# EAGLE design mintymp3 v1.1 (EAGLE 6.6.0)
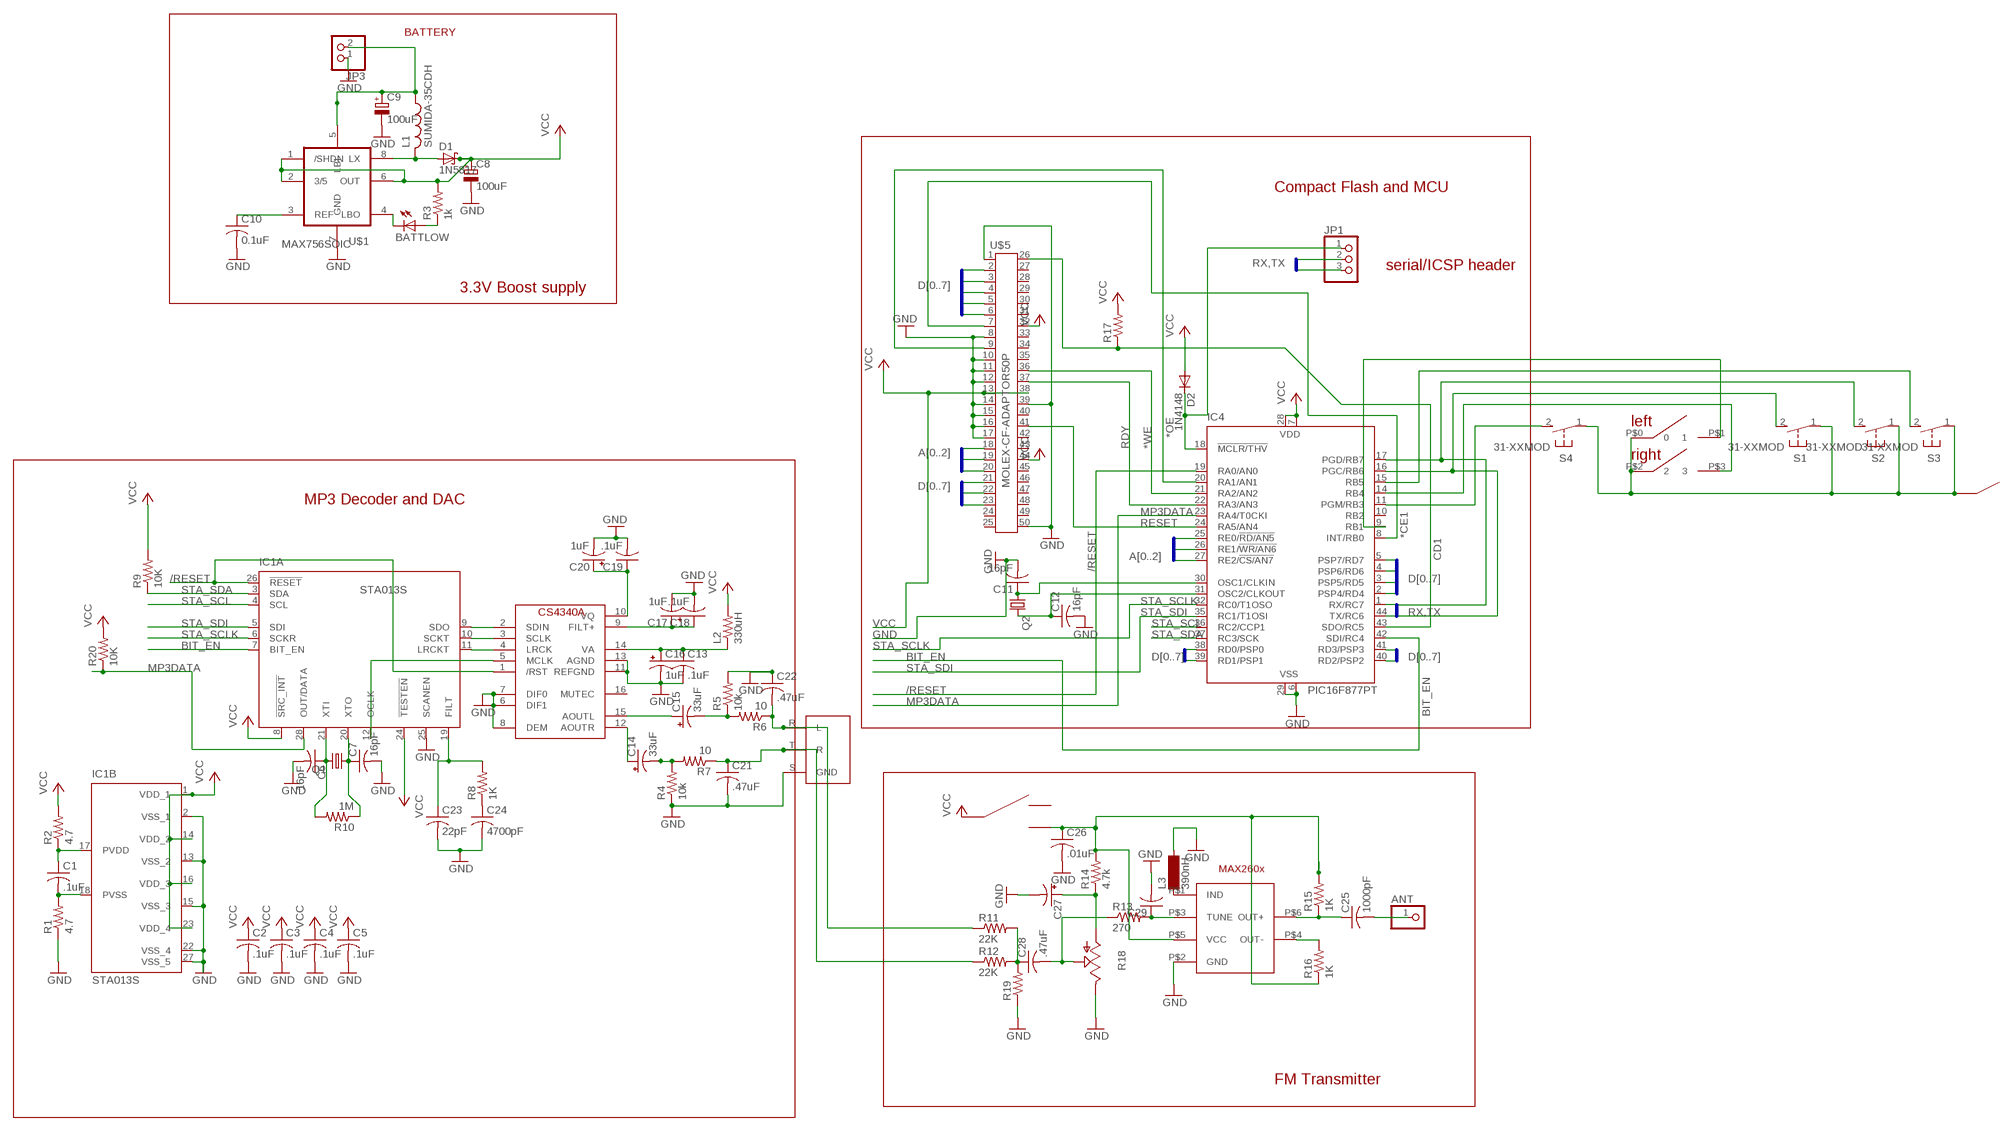
[diagram p0: schematic, sheet 1, part 1 of 2]
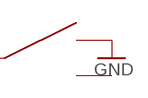
[diagram p1: schematic, sheet 1, part 2 of 2]

## Parts
ANT  PINHD-1X1  [1X01]
BATTLOW  LED3MM  [LED3MM]
C1  .1uF  C-USC1206  [C1206]
C2  .1uF  C-USC1206  [C1206]
C3  .1uF  C-USC1206  [C1206]
C4  .1uF  C-USC1206  [C1206]
C5  .1uF  C-USC1206  [C1206]
C6  16pF  C-USC1206  [C1206]
C7  16pF  C-USC1206  [C1206]
C8  100uF  CPOL-EUD  [PANASONIC_D]
C9  100uF  CPOL-EUD  [PANASONIC_D]
C10  0.1uF  C-USC1206  [C1206]
C11  16pF  C-USC1206  [C1206]
C12  16pF  C-USC1206  [C1206]
C13  .1uF  C-USC1206  [C1206]
C14  33uF  CPOL-USB  [PANASONIC_B]
C15  33uF  CPOL-USB  [PANASONIC_B]
C16  1uF  CPOL-USA  [PANASONIC_A]
C17  1uF  CPOL-USA  [PANASONIC_A]
C18  .1uF  C-USC1206  [C1206]
C19  .1uF  C-USC1206  [C1206]
C20  1uF  CPOL-USA  [PANASONIC_A]
C21  .47uF  C-USC1206  [C1206]
C22  .47uF  C-USC1206  [C1206]
C23  22pF  C-USC1206  [C1206]
C24  4700pF  C-USC1206  [C1206]
C25  1000pF  C-USC1206  [C1206]
C26  .01uF  C-USC1206  [C1206]
C27  CPOL-USB  [PANASONIC_B]
C28  .47uF  C-USC1206  [C1206]
C29  C-USC1206  [C1206]
D1  1N5817  SCHOTTKY-DIODEDO35-7  [DO35-7]
D2  1N4148  1N4148DO35-10  [DO35-10]
FM_SWITCH  SLIDE_SW  [SLIDESWITCH]
HEADPHONE  STEREOJACKSMDMOD  [SJ-3523-MODIFIED]
IC1  STA013S  [SO28W]
IC4  PIC16F877PT  [TQFP44]
JP1  PINHD-1X3  [1X03]
JP3  PINHD-1X2  [1X02]
L1  SUMIDA-35CDH  [CDH53]
L2  330uH  R-US_R1210  [R1210]
L3  390nH  SM-1206  [SM-1206]
Q1  CRYSTALHC49UP  [HC49UP]
Q2  CRYSTALHC49UP  [HC49UP]
R1  4.7  R-US_R1206  [R1206]
R2  4.7  R-US_R1206  [R1206]
R3  1k  R-US_R1206  [R1206]
R4  10k  R-US_R1206  [R1206]
R5  10k  R-US_R1206  [R1206]
R6  10  R-US_R1206  [R1206]
R7  10  R-US_R1206  [R1206]
R8  1K  R-US_R1206  [R1206]
R9  10K  R-US_R1206  [R1206]
R10  1M  R-US_R1206  [R1206]
R11  22K  R-US_R1206  [R1206]
R12  22K  R-US_R1206  [R1206]
R13  270  R-US_R1206  [R1206]
R14  4.7k  R-US_R1206  [R1206]
R15  1K  R-US_R1206  [R1206]
R16  1K  R-US_R1206  [R1206]
R17  R-US_R1206  [R1206]
R18  TRIM_US-ECP10P  [ECP10P]
R19  R-US_R1206  [R1206]
R20  10K  R-US_R1206  [R1206]
S1  31-XXMOD  [B3F-31XX-MODIFIED]
S2  31-XXMOD  [B3F-31XX-MODIFIED]
S3  31-XXMOD  [B3F-31XX-MODIFIED]
S4  31-XXMOD  [B3F-31XX-MODIFIED]
U$1  MAX756SOIC  [SO08]
U$2  SLIDE_SW  [SLIDESWITCH]
U$3  TPC_SWITCH  [TPC_SCAN]
U$4  CS4340A  [SO16]
U$5  MOLEX-CF-ADAPTOR50P  [COMPACTFLASH]
U$9  MAX260X  [SOT23-6]

## Nets
*CE1: IC4.8(INT/RB0) U$5.7
*OE: IC4.20(RA1/AN1) U$5.9
*WE: IC4.21(RA2/AN2) U$5.36
/RESET: IC1.26(A:!RESET) IC4.19(RA0/AN0) U$4.1(/RST)
A0: IC4.25(RE0/!RD/AN5) U$5.20
A1: IC4.26(RE1/!WR/AN6) U$5.19
A2: IC4.27(RE2/!CS/AN7) U$5.18
ANTENNA: ANT.1 C25.2
BIT_EN: IC1.7(A:BIT_EN) IC4.42(SDI/RC4)
BUTTON1: IC4.11(PGM/RB3) S4.2(S)
CD1: IC4.43(SDO/RC5) R17.1 U$5.26
D0: IC4.38(RD0/PSP0) U$5.21
D1: IC4.39(RD1/PSP1) U$5.22
D2: IC4.40(RD2/PSP2) U$5.23
D3: IC4.41(RD3/PSP3) U$5.2
D4: IC4.2(PSP4/RD4) U$5.3
D5: IC4.3(PSP5/RD5) U$5.4
D6: IC4.4(PSP6/RD6) U$5.5
D7: IC4.5(PSP7/RD7) U$5.6
GND: C2.2 C3.2 C4.2 C5.2 C6.2 C7.2 C8.- C9.- C10.2 C11.2 C12.2 C13.2 C16.- C17.- C18.2 C19.2 C20.- C21.2 C22.1 C23.2 C24.2 C26.2 C27.- C29.2 HEADPHONE.S(GND) IC1.2(B:VSS_1) IC1.13(B:VSS_2) IC1.15(B:VSS_3) IC1.22(B:VSS_4) IC1.25(A:SCANEN) IC1.27(B:VSS_5) IC4.6(VSS) IC4.29(VSS) JP3.1 L3.2 R1.1 R4.1 R5.2 R18.E R19.1 U$1.7(GND) U$2.P$1 U$4.6(DIF1) U$4.7(DIF0) U$4.8(DEM) U$4.11(REFGND) U$4.13(AGND) U$5.1 U$5.8 U$5.10 U$5.11 U$5.12 U$5.14 U$5.15 U$5.16 U$5.17 U$5.39 U$5.50 U$9.P$2(GND)
MCLR: D2.C IC4.18(!MCLR/THV) JP1.1
MP3DATA: IC1.28(A:OUT/DATA) IC4.23(RA4/T0CKI) R20.1
N$2: C26.1 FM_SWITCH.P$3 R14.2 R15.2 R16.1 U$9.P$5(VCC)
N$3: C6.1 IC1.21(A:XTI) Q1.2 R10.2
N$4: C7.1 IC1.20(A:XTO) Q1.1 R10.1
N$5: IC4.14(RB4) U$3.P$3
N$6: C1.1 IC1.17(B:PVDD) R2.1
N$7: C1.2 IC1.18(B:PVSS) R1.2
N$8: C9.+ JP3.2 L1.P$1 U$1.5(LBI)
N$9: D1.A L1.P$2 U$1.8(LX)
N$10: IC1.9(A:SDO) U$4.2(SDIN)
N$11: IC1.10(A:SCKT) U$4.3(SCLK)
N$12: IC1.11(A:LRCKT) U$4.4(LRCK)
N$13: IC1.12(A:OCLK) U$4.5(MCLK)
N$14: IC4.9(RB1) U$3.P$1
N$16: IC4.15(RB5) S3.2(S)
N$17: C15.+ U$4.15(AOUTL)
N$18: C10.1 U$1.3(REF)
N$19: BATTLOW.A R3.1
N$20: BATTLOW.K(C) U$1.4(LBO)
N$21: C13.1 C16.+ L2.1 U$4.14(VA)
N$22: C11.1 IC4.30(OSC1/CLKIN) Q2.1
N$23: C12.1 IC4.31(OSC2/CLKOUT) Q2.2
N$24: C14.+ U$4.12(AOUTR)
N$25: C14.- R4.2 R7.2
N$26: C15.- R5.1 R6.2
N$28: C22.2 HEADPHONE.R(L) R6.1 R11.1
N$29: C17.+ C18.1 U$4.9(FILT+)
N$30: C19.1 C20.+ U$4.10(VQ)
N$31: C29.1 R13.2 U$9.P$3(TUNE)
N$32: C24.1 R8.1
N$33: C23.1 IC1.19(A:FILT) R8.2
N$35: C25.1 R15.1 U$9.P$6(OUT+)
N$36: R16.2 U$9.P$4(OUT-)
N$37: C21.1 HEADPHONE.T(R) R7.1 R12.1
N$38: C28.1 R11.2 R12.2 R19.2
N$39: C27.+ R14.1 R18.A
N$40: C28.2 R13.1 R18.S
N$42: L3.1 U$9.P$1(IND)
N$43: S1.1(P) S2.1(P) S3.1(P) S4.1(P) U$2.P$2 U$3.P$0 U$3.P$2
RDY: IC4.22(RA3/AN3) U$5.37
RESET: IC4.24(RA5/AN4) U$5.41
RX: IC4.1(RX/RC7) IC4.17(PGD/RB7) JP1.2 S2.2(S)
STA_SCL: IC1.4(A:SCL) IC4.36(RC2/CCP1)
STA_SCLK: IC1.6(A:SCKR) IC4.32(RC0/T1OSO)
STA_SDA: IC1.3(A:SDA) IC4.37(RC3/SCK) R9.1
STA_SDI: IC1.5(A:SDI) IC4.35(RC1/T1OSI)
TX: IC4.16(PGC/RB6) IC4.44(TX/RC6) JP1.3 S1.2(S)
VCC: C2.1 C3.1 C4.1 C5.1 C8.+ D1.C D2.A FM_SWITCH.P$2 IC1.1(B:VDD_1) IC1.8(A:!SRC_INT) IC1.14(B:VDD_2) IC1.16(B:VDD_3) IC1.23(B:VDD_4) IC1.24(A:!TESTEN) IC4.7(VDD) IC4.28(VDD) L2.2 R2.2 R3.2 R9.2 R17.2 R20.2 U$1.1(/SHDN) U$1.2(3/5) U$1.6(OUT) U$5.13 U$5.32 U$5.38 U$5.44
Unconnected: FM_SWITCH.P$1 IC4.10(RB2) U$2.P$3 U$4.16(MUTEC) U$5.24 U$5.25 U$5.27 U$5.28 U$5.29 U$5.30 U$5.31 U$5.33 U$5.34 U$5.35 U$5.40 U$5.42 U$5.43 U$5.45 U$5.46 U$5.47 U$5.48 U$5.49

## Buses
D[0..7]
A[0..2]
RX,TX

## Notes on the sheet
- BATTERY
- Compact Flash and MCU
- serial/ICSP header
- 3.3V Boost supply
- MP3 Decoder and DAC
- FM Transmitter

## Library data of the parts
ANT = pinhead:PINHD-1X1: PIN HEADER
BATTLOW = led:LED: LED OSRAM: - CHIPLED LG R971, LG N971, LY N971, LG Q971, LY Q971, LO R971, LY R971 LH N974, LH R974 LS Q976, LO Q976, LY Q976 LO Q996 - Hyper CHIPLED LW Q18S LB Q993, LB Q99A, LB R99A - SideLED LS A670, LO A670, LY A670, LG A670, LP A670 LB A673, LV A673, LT A673, LW A673 LH A674 LY A675 LS A676, LA A676, LO A676, LY A676, LW A676 LS A679, LY A679, LG A679 - Hyper Micro SIDELED® LS Y876, LA Y876, LO Y876, LY Y876 LT Y87S - SmartLED LW L88C, LW L88S LB L89C, LB L89S, LG L890 LS L89K, LO L89K, LY L89K LS L896, LA L896, LO L896, LY L896 - TOPLED LS T670, LO T670, LY T670, LG T670, LP T670 LSG T670, LSP T670, LSY T670, LOP T670, LYG T670 LG T671, LOG T671, LSG T671 LB T673, LV T673, LT T673, LW T673 LH T674 LS T676, LA T676, LO T676, LY T676, LB T676, LH T676, LSB T676, LW T676 LB T67C, LV T67C, LT T67C, LS T67K, LO T67K, LY T67K, LW E67C LS E67B, LA E67B, LO E67B, LY E67B, LB E67C, LV E67C, LT E67C LW T67C LS T679, LY T679, LG T679 LS T770, LO T770, LY T770, LG T770, LP T770 LB T773, LV T773, LT T773, LW T773 LH T774 LS E675, LA E675, LY E675, LS T675 LS T776, LA T776, LO T776, LY T776, LB T776 LHGB T686 LT T68C, LB T68C - Hyper Mini TOPLED® LB M676 - Mini TOPLED Santana® LG M470 LS M47K, LO M47K, LY M47K Source: http://www.osram.convergy.de LUXEON: - LUMILED® LXK2-PW12-R00, LXK2-PW12-S00, LXK2-PW14-U00, LXK2-PW14-V00 LXK2-PM12-R00, LXK2-PM12-S00, LXK2-PM14-U00 LXK2-PE12-Q00, LXK2-PE12-R00, LXK2-PE12-S00, LXK2-PE14-T00, LXK2-PE14-U00 LXK2-PB12-K00, LXK2-PB12-L00, LXK2-PB12-M00, LXK2-PB14-N00, LXK2-PB14-P00, LXK2-PB14-Q00 LXK2-PR12-L00, LXK2-PR12-M00, LXK2-PR14-Q00, LXK2-PR14-R00 LXK2-PD12-Q00, LXK2-PD12-R00, LXK2-PD12-S00 LXK2-PH12-R00, LXK2-PH12-S00 LXK2-PL12-P00, LXK2-PL12-Q00, LXK2-PL12-R00 Source: www.luxeon.com KINGBRIGHT: KA-3528ASYC Source: www.kingbright.com
C1-C7 C10-C13 C18 C19 C21-C26 C28 C29 = rcl:C-US: CAPACITOR, American symbol
C8 C9 = rcl:CPOL-EU: POLARIZED CAPACITOR, European symbol
C14-C17 C20 C27 = rcl:CPOL-US: POLARIZED CAPACITOR, American symbol
D1 = diode:SCHOTTKY-DIODE: Schottky Diode
D2 = diode:1N4148: DIODE high speed (Philips)
FM_SWITCH U$2 = mp3:SLIDE_SW
HEADPHONE = mp3:STEREOJACK: CUI SJ-3533-N
IC1 = st-microelectronics:STA013S: MP3 AUDIO DECODER; MPN: STA013$; OC_FARNELL: unknown; OC_NEWARK: 57P0489
IC4 = microchip:PIC16F87*: MICROCONTROLLER; MF: MICROCHIP; MPN: PIC16F877-04/PQ; OC_FARNELL: 9761411; OC_NEWARK: 23C5094
JP1 = pinhead:PINHD-1X3: PIN HEADER
JP3 = pinhead:PINHD-1X2: PIN HEADER
L1 = mp3:SUMIDA-35CDH
L2 R1-R17 R19 R20 = rcl:R-US_: RESISTOR, American symbol
L3 = inductor-neosid:SM-1206: INDUCTOR SMD chip inductor; OC_FARNELL: unknown; OC_NEWARK: unknown
Q1 Q2 = crystal:CRYSTAL: CRYSTAL; OC_FARNELL: unknown; OC_NEWARK: unknown
R18 = pot:TRIM_US-: POTENTIOMETER
S1-S4 = mp3:31-XX: OMRON SWITCH
U$1 = mp3:MAX756
U$3 = mp3:TPC_SWITCH
U$4 = mp3:CS4340A
U$5 = mp3:MOLEX-CF-ADAPTOR
U$9 = mp3:MAX260X

## Board
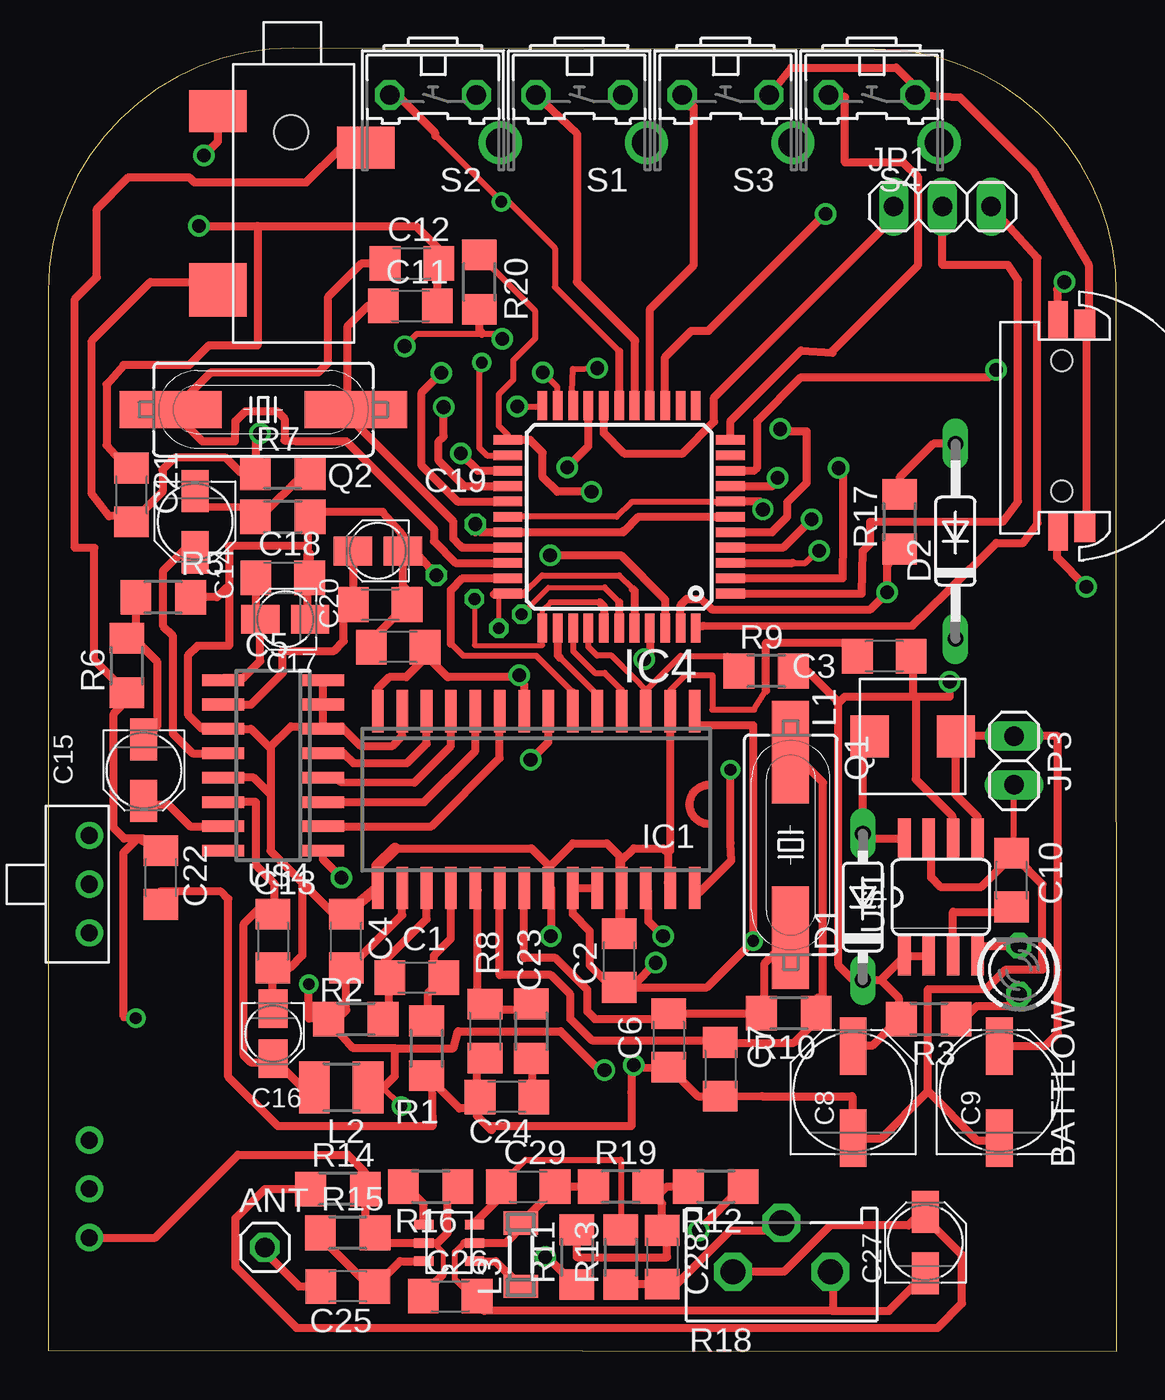
[diagram p2: board, top side]
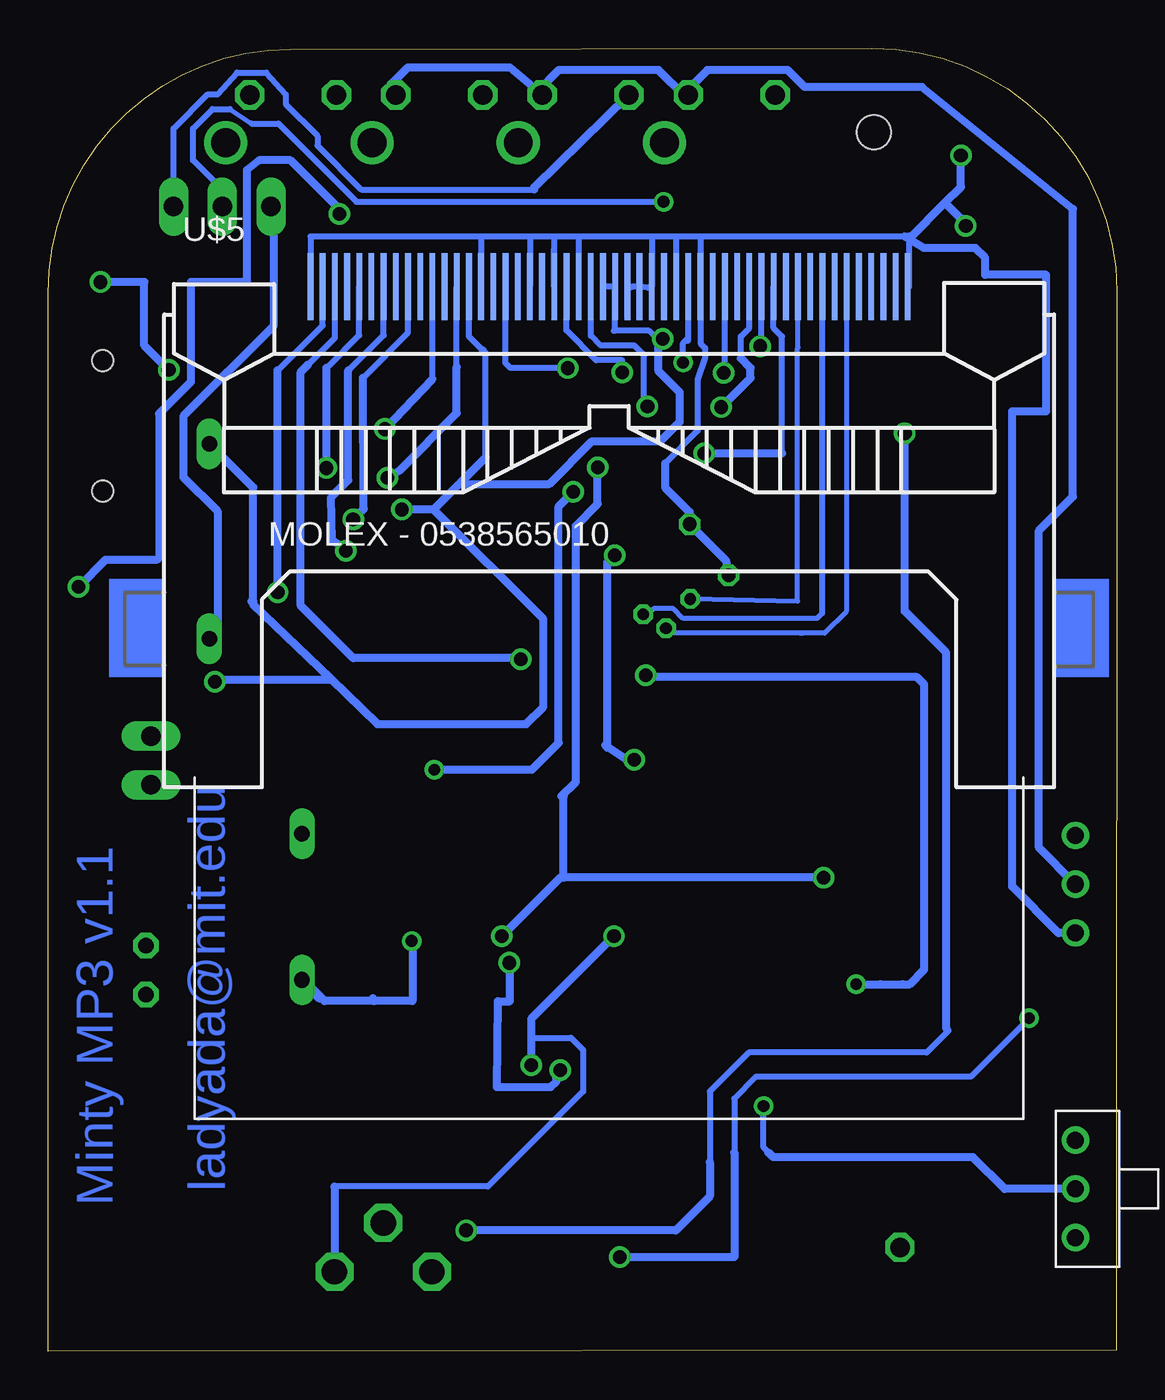
[diagram p3: board, bottom side, seen from below]

Size 55.69 x 67.92 mm. Coordinates in mm from the lower left corner, seen from the top.
Outline: 0.02,0.05 55.69,0 55.67,55.15 arc90 43.06,67.86 12.76,67.91 arc90 0,55.24 0.02,0.05
Copper layers (1*16): Top 0.035mm / dielectric 1.5mm / Bottom 0.035mm
Design rules "default": minimum track width 10mil, minimum drill 24mil, track to track 10mil, track to pad 10mil, pad to pad 10mil, via to via 10mil, smd to smd 8mil, copper to edge 20mil, drill to drill 8mil, minimum pad ring 10mil, minimum via ring 8mil, stop-mask expansion 4mil, vias tented up to drill 0mil, thermal gap 10mil

### Footprints (pad centres in the part's own frame; a part is rotated, then mirrored left to right if it is on the bottom)
1X01 = drill 1.016 octagon: 1 0,0
LED3MM = drill 0.813 octagon: A -1.27,0; K 1.27,0
C1206 = smd 1.6 x 1.8: 1 -1.4,0; 2 1.4,0
PANASONIC_D = smd 3 x 1.4: + 2.4,0; - -2.4,0
PANASONIC_B = smd 2.2 x 1.4: + 1.6,0; - -1.6,0
PANASONIC_A = smd 2 x 1.5: + 1.3,0; - -1.3,0
DO35-7 = drill 0.813 long: A 3.81,0; C -3.81,0
DO35-10 = drill 0.813 long: A 5.08,0; C -5.08,0
SLIDESWITCH = drill 0.889 pad 1.422: P$1 -2.54,1.016; P$2 0,1.016; P$3 2.54,1.016
SJ-3523-MODIFIED = smd 2.2 x 3: R -3.27,3.82; S -5.17,-3.88 | smd 2.8 x 3: T 4.13,-3.88 | hole 1.778: -4.07,-0.08
SO28W = smd 0.6 x 2.2: 1 -8.255,-4.6; 2 -6.985,-4.6; 3 -5.715,-4.6; 4 -4.445,-4.6; 5 -3.175,-4.6; 6 -1.905,-4.6; 7 -0.635,-4.6; 8 0.635,-4.6; 9 1.905,-4.6; 10 3.175,-4.6; 11 4.445,-4.6; 12 5.715,-4.6; 13 6.985,-4.6; 14 8.255,-4.6; 15 8.255,4.6; 16 6.985,4.6; 17 5.715,4.6; 18 4.445,4.6; 19 3.175,4.6; 20 1.905,4.6; 21 0.635,4.6; 22 -0.635,4.6; 23 -1.905,4.6; 24 -3.175,4.6; 25 -4.445,4.6; 26 -5.715,4.6; 27 -6.985,4.6; 28 -8.255,4.6
TQFP44 = smd 1.5 x 0.5: 1 -5.8,4; 2 -5.8,3.2; 3 -5.8,2.4; 4 -5.8,1.6; 5 -5.8,0.8; 6 -5.8,0; 7 -5.8,-0.8; 8 -5.8,-1.6; 9 -5.8,-2.4; 10 -5.8,-3.2; 11 -5.8,-4; 23 5.8,-4; 24 5.8,-3.2; 25 5.8,-2.4; 26 5.8,-1.6; 27 5.8,-0.8; 28 5.8,0; 29 5.8,0.8; 30 5.8,1.6; 31 5.8,2.4; 32 5.8,3.2; 33 5.8,4 | smd 0.5 x 1.5: 12 -4,-5.8; 13 -3.2,-5.8; 14 -2.4,-5.8; 15 -1.6,-5.8; 16 -0.8,-5.8; 17 0,-5.8; 18 0.8,-5.8; 19 1.6,-5.8; 20 2.4,-5.8; 21 3.2,-5.8; 22 4,-5.8; 34 4,5.8; 35 3.2,5.8; 36 2.4,5.8; 37 1.6,5.8; 38 0.8,5.8; 39 0,5.8; 40 -0.8,5.8; 41 -1.6,5.8; 42 -2.4,5.8; 43 -3.2,5.8; 44 -4,5.8
1X03 = drill 1.016 long: 1 -2.54,0; 2 0,0; 3 2.54,0
1X02 = drill 1.016 long: 1 -1.27,0; 2 1.27,0
CDH53 = smd 2.2 x 2: P$1 1,1; P$2 1,5.5
R1210 = smd 1.6 x 2.7: 1 -1.4,0; 2 1.4,0
SM-1206 = smd 1.2 x 1.8: 1 -1.65,0; 2 1.65,0
HC49UP = smd 5.334 x 1.93: 1 -4.826,0; 2 4.826,0
R1206 = smd 1.6 x 1.803: 1 -1.422,0; 2 1.422,0
ECP10P = drill 1.321 octagon: A -2.54,0; E 2.54,0; S 0,2.54
B3F-31XX-MODIFIED = drill 1.016 octagon: 1 -2.261,-1.245; 2 2.261,-1.245 | drill 1.499 pad 2.159: 3 -3.505,1.245
SO08 = smd 0.66 x 2.032: 1 -1.905,-3.073; 2 -0.635,-3.073; 3 0.635,-3.073; 4 1.905,-3.073; 5 1.905,3.073; 6 0.635,3.073; 7 -0.635,3.073; 8 -1.905,3.073
TPC_SCAN = smd 1.5 x 1.1: P$0 -5.3,1.2; P$2 5.3,1.2 | smd 2 x 1: P$1 -5.5,-0.2; P$3 5.5,-0.2 | hole 1.1: -3.4,0; 3.4,0
SO16 = smd 0.6 x 2.2: 1 -4.445,-2.6; 2 -3.175,-2.6; 3 -1.905,-2.6; 4 -0.635,-2.6; 5 0.635,-2.6; 6 1.905,-2.6; 7 3.175,-2.6; 8 4.445,-2.6; 9 4.445,2.6; 10 3.175,2.6; 11 1.905,2.6; 12 0.635,2.6; 13 -0.635,2.6; 14 -1.905,2.6; 15 -3.175,2.6; 16 -4.445,2.6
COMPACTFLASH = smd 0.3 x 3.5: 1 -16.828,10.335; 2 -15.557,10.335; 3 -14.287,10.335; 4 -13.018,10.335; 5 -11.748,10.335; 6 -10.477,10.335; 7 -9.207,10.335; 8 -7.938,10.335; 9 -6.668,10.335; 10 -5.397,10.335; 11 -4.128,10.335; 12 -2.857,10.335; 13 -1.587,10.335; 14 -0.318,10.335; 15 0.953,10.335; 16 2.223,10.335; 17 3.493,10.335; 18 4.763,10.335; 19 6.032,10.335; 20 7.303,10.335; 21 8.572,10.335; 22 9.842,10.335; 23 11.113,10.335; 24 12.383,10.335; 25 13.652,10.335; 26 -16.192,10.335; 27 -14.922,10.335; 28 -13.652,10.335; 29 -12.383,10.335; 30 -11.113,10.335; 31 -9.842,10.335; 32 -8.572,10.335; 33 -7.303,10.335; 34 -6.032,10.335; 35 -4.763,10.335; 36 -3.493,10.335; 37 -2.223,10.335; 38 -0.953,10.335; 39 0.318,10.335; 40 1.587,10.335; 41 2.857,10.335; 42 4.128,10.335; 43 5.397,10.335; 44 6.668,10.335; 45 7.938,10.335; 46 9.207,10.335; 47 10.477,10.335; 48 11.748,10.335; 49 13.018,10.335; 50 14.287,10.335
SOT23-6 = smd 0.5 x 1: P$1 0.3,0.5; P$2 1.25,0.5; P$3 2.2,0.5; P$4 2.2,3.15; P$5 1.25,3.15; P$6 0.3,3.15

### Placement (x,y rotation side)
ANT  11.3,5.42 0 top
BATTLOW  50.59,19.87 90 top
C1  19.22,19.49 0 top
C2  29.76,20.38 90 top
C3  43.58,36.22 180 top
C4  15.54,21.39 90 top
C5  18.25,36.7 180 top
C6  32.35,16.21 270 top
C7  35.03,14.71 270 top
C8  41.95,13.52 90 top
C9  49.57,13.52 90 top
C10  50.21,24.57 90 top
C11  18.88,54.48 0 top
C12  18.96,56.7 0 top
C13  11.73,21.39 270 top
C14  7.66,43.23 270 top
C15  4.99,30.28 270 top
C16  11.73,16.57 270 top
C17  12.36,38.16 180 top
C18  12.23,40.31 0 top
C19  17.31,38.92 0 top
C20  17.19,41.71 180 top
C21  4.36,44.63 90 top
C22  5.88,24.69 90 top
C23  22.77,16.69 270 top
C24  23.92,13.26 180 top
C25  15.62,3.39 180 top
C26  20.95,2.88 0 top
C27  45.72,5.68 90 top
C28  32,4.92 270 top
C29  25.02,8.6 0 top
D1  42.46,23.17 90 top
D2  47.29,42.22 90 top
FM_SWITCH  3.17,8.47 270 bottom
HEADPHONE  12.74,59.45 270 top
IC1  25.44,28.76 180 top
IC4  29.76,43.49 180 top
JP1  46.61,59.65 0 top
JP3  50.33,30.79 90 top
L1  48.3,31.04 90 top
L2  15.28,13.77 0 top
L3  24.64,5.04 90 top
Q1  38.7,26.4 270 top
Q2  11.22,49.08 180 top
R1  19.73,15.8 90 top
R2  16.04,17.33 180 top
R3  45.89,17.33 180 top
R4  12.23,43.49 180 top
R5  6.01,39.3 0 top
R6  4.11,35.74 90 top
R7  12.23,45.77 0 top
R8  25.19,16.69 90 top
R9  37.42,35.46 0 top
R10  38.6,17.64 180 top
R11  27.56,4.92 90 top
R12  34.8,8.6 180 top
R13  29.84,4.92 90 top
R14  15.11,8.47 0 top
R15  15.62,6.19 0 top
R16  19.94,8.6 180 top
R17  44.36,43.23 90 top
R18  38.23,4.15 0 top
R19  29.84,8.6 0 top
R20  22.48,55.72 270 top
S1  27.69,64.22 180 top
S2  20.07,64.22 180 top
S3  35.31,64.22 180 top
S4  42.93,64.22 180 top
U$1  46.52,23.68 0 top
U$2  3.17,24.35 90 top
U$3  52.83,48.22 270 top
U$4  11.73,30.54 90 top
U$5  25.19,45.14 0 bottom
U$9  22.73,4.41 90 top

### Tracks (layer width: path | path; a pad name or v marks a point on that pad's centre or on a via)
*CE1  (via drill 0.71)
  Top 0.406: IC4.8 37.77,45.1 38.14,45.47 v38.01,45.52
  Bottom 0.305: 34.4,51.3 U$5.7
  Bottom 0.406: v38.01,45.52 37.37,45.9 34.4,48.88 34.4,51.3
*OE  (via drill 0.71)
  Top 0.305: v28.62,51.24 27.35,51.19 27.3,50 27.36,49.95 IC4.20
  Bottom 0.305: v28.62,51.24 31.59,51.24 31.86,51.5 U$5.9
*WE  (via drill 0.71)
  Top 0.305: v25.78,51.02 26.54,50.26 26.54,49.37 26.56,49.35 IC4.21
  Bottom 0.305: U$5.36 28.68,53.2 27.13,51.65 25.78,51.65 v25.78,51.02
/RESET  (via drill 0.71)
  Top 0.406: v32.05,21.64 31.28,22.41 31.28,23.93 31.16,23.93 | 31.16,23.93 31.03,23.93 | 31.16,23.93 IC1.26 | U$4.1 14.33,25.65 v15.28,24.69 | IC4.19 28.16,47.17 v27.05,46.06
  Bottom 0.406: v15.28,24.69 28.83,24.69 | 28.83,24.69 29,24.69 v32.05,21.64 30.74,22.95 | v27.05,46.06 27.05,44.16 28.19,43.02 28.19,29.68 28.96,28.92 28.83,28.92 28.83,24.69
A0  (via drill 0.71)
  Top 0.406: IC4.25 22.41,45.89 v21.5,46.79
  Bottom 0.305: U$5.20 17.89,53.33 17.44,52.89 17.44,46.79
  Bottom 0.406: 17.44,46.79 v21.5,46.79
A1  (via drill 0.71)
  Top 0.406: v20.62,49.2 20.62,47.68 20.36,47.43 20.36,46.41 21.68,45.09 IC4.26
  Bottom 0.305: U$5.19 19.16,53.33 19.6,52.89 19.6,51.74
  Bottom 0.406: 19.6,51.74 19.09,51.24 19.09,50.73 v20.62,49.2
A2  (via drill 0.71)
  Top 0.406: v20.49,50.98 19.47,49.97 19.47,46.16 21.34,44.29 IC4.27
  Bottom 0.305: 20.43,51.17 U$5.18
  Bottom 0.406: v20.49,50.98 20.43,51.17
ANTENNA
  Top 0.406: ANT.1 11.3,5.17 13.08,3.39 C25.2
BIT_EN  (via drill 0.71)
  Top 0.406: IC4.42 32.16,39.18 29.84,41.49 v26.16,41.49 | IC1.7 26.08,31.76 v25.15,30.82
  Bottom 0.406: v26.16,41.49 26.54,41.11 26.54,31.46 26.67,31.59 25.53,30.82 v25.15,30.82
BUTTON1
  Top 0.406: IC4.11 35.56,48.48 39.24,52.16 40.89,52.03 40.89,52.16 45.34,56.61 45.34,61.18 44.58,61.94 41.53,61.94 41.53,65.37 41.3,65.37 S4.2
CD1  (via drill 0.71)
  Top 0.406: 32.96,37.62 IC4.43 32.96,38.89 33.27,39.21 34.04,39.21 34.2,39.04 34.59,38.66 42.84,38.66 v43.73,39.55 43.73,40.95 44.34,41.81 R17.1
  Bottom 0.305: U$5.26 41.38,53.46 43.73,51.11
  Bottom 0.406: v43.73,39.55 43.73,51.11
D0  (via drill 0.61)
  Top 0.254: 26.2,39.04 25.78,38.62 25.78,36.79 22.22,36.79 v22.22,39.21
  Top 0.305: 26.2,39.04 28.74,39.04
  Top 0.406: IC4.38 28.96,38.82 28.74,39.04
  Bottom 0.254: v22.22,39.21 16.64,39.08 16.64,52.29 16.61,52.31 U$5.21
D1  (via drill 0.61)
  Top 0.254: 29,39.81 26.08,39.81 v24.68,38.41
  Top 0.305: 29,39.81 29.76,39.04
  Top 0.406: 29.76,39.04 IC4.39
  Bottom 0.254: 15.35,38.47 15.37,38.45 15.37,38.44 15.62,38.19 22.61,38.19 23.11,38.7 24.14,38.7 24.39,38.44 v24.68,38.41
  Bottom 0.305: 15.35,55.49 U$5.22 15.35,38.47
D2  (via drill 0.61)
  Top 0.254: 23.24,39.46 23.49,39.33 v23.49,37.68
  Top 0.305: 30.52,39.68 30.48,39.72 29.76,40.44 25.75,40.44 24.76,39.46
  Top 0.406: 30.48,39.72 30.48,39.71 30.56,39.63 IC4.40 | 23.24,39.46 24.76,39.46
  Bottom 0.254: v23.49,37.68 23.49,37.43 16.51,37.43 | 16.51,37.43 16.38,37.43 | U$5.23 14.07,38.59 15.24,37.43 16.51,37.43
D3  (via drill 0.71)
  Top 0.406: v31.06,36.07 31.06,36.11 31.36,36.4 IC4.41
  Bottom 0.305: 42.21,51.36 42.17,51.4 40.74,52.82 U$5.2
  Bottom 0.406: v31.06,36.07 v31.08,36.07 31.11,36.03 31.21,36.12 39.79,36.12 42.52,38.85 42.52,51.04 42.16,51.4 42.17,51.4
D4  (via drill 0.71)
  Top 0.406: IC4.2 41.42,40.29 41.44,42.35 41.44,45.77 v41.19,46.03
  Bottom 0.305: 41.19,51.24 41.06,51.36 39.48,52.94 U$5.3
  Bottom 0.406: v41.19,46.03 41.19,51.24
D5  (via drill 0.71)
  Top 0.305: v40.17,41.71 40.13,41.75 39.47,41.09 38.79,41.09
  Top 0.406: IC4.3 38.79,41.09
  Bottom 0.305: U$5.4 38.2,52.95 40.05,51.11
  Bottom 0.406: v40.17,41.71 40.17,41.79 40.89,42.25 40.94,44.51 40.05,45.39 40.05,51.11
D6  (via drill 0.71)
  Top 0.406: IC4.4 38.32,41.89 v39.79,43.36
  Bottom 0.305: U$5.5 36.94,53.08 39.28,50.73
  Bottom 0.406: v39.79,43.36 39.54,43.61 39.24,43.91 39.28,50.73
D7  (via drill 0.71)
  Top 0.406: IC4.5 37.72,42.69 38.52,43.49 38.52,44.25 39.54,45.27 39.54,47.93 38.26,47.93 38.13,48.06 | 38.13,48.06 38.1,48.1 | 38.13,48.06 v38.14,48.06
  Bottom 0.305: 35.66,50.66 U$5.6
  Bottom 0.406: v38.14,48.06 35.66,50.66
GND  (via drill 0.71)
  Top 0.305: 32.3,25.96 32.43,26.09 | IC1.2 32.43,34.45 33.21,35.24 34.61,35.24 34.61,33.44 36.79,33.44 37.41,34.44 | 21.7,5.66 21.21,5.17 21.21,3.77 22.1,2.88 | 50.18,25.87 50.17,25.87 50.16,25.87 50.33,26.04 JP3.1
  Top 0.406: IC1.27 32.43,24.31 32.3,24.44 32.3,25.96 32.05,26.22 30.52,26.22 29.89,25.58 IC1.25 29.89,22.03 29.76,21.9 C2.2 29.76,25.84 29.12,26.47 27.35,26.47 26.08,25.2 | 26.08,25.2 26.08,25.33 25.19,26.22 18.08,26.22 | C19.2 18.33,38.54 | 30.4,14.78 C6.2 33.86,13.3 35.05,13.3 | v30.52,14.91 30.4,14.78 | v26.2,21.64 26.2,24.19 26.08,24.31 | 22.9,11.74 30.39,11.74 30.4,13.52 30.4,14.78 | 46.02,26.73 45.99,26.75 U$1.7 | 46.02,26.73 45.89,26.6 | 46.02,26.73 46.02,24.69 46.52,24.19 48.61,24.19 50.13,25.71 50.18,25.87 C10.2 50.45,25.71 51.82,24.35 51.82,19.9 49.91,19.9 48.89,18.89 45.85,18.89 45.85,13.57 | 11.6,29.01 11.6,31.42 11.56,31.46 | 13.25,24.44 13.25,20.63 12.61,19.99 C13.2 11.68,19.95 11.68,17.91 C16.- | 13.25,24.44 11.6,26.09 11.6,29.01 | 14.27,32.57 14.33,32.51 U$4.6 | 14.27,32.57 14.33,32.63 U$4.7 14.33,33.78 14.27,33.84 14.33,33.9 U$4.8 | 26.08,25.2 26.08,24.31 | 26.08,24.31 IC1.22 | 11.56,31.46 10.58,32.44 9.19,32.44 | 9.19,32.44 U$4.11 | 9.19,32.44 8.04,32.44 7.28,33.2 7.28,36.25 7.79,36.76 9.44,36.76 9.44,39.81 | 11.6,29.01 10.71,29.9 U$4.13 | 30.01,42.72 29.98,42.69 | 30.01,42.72 30.78,43.49 IC4.6 | 32.43,26.09 IC1.2 | v22.27,43.11 22.27,42.89 | 22.27,42.89 22.27,42.69 | IC1.13 18.46,33.33 | IC1.13 18.46,33.46 | 14.27,32.57 15.28,32.57 16.3,31.55 17.95,31.55 18.46,32.06 IC1.13 | 13.53,41.48 13.63,41.59 C18.2 | 13.53,43.74 13.53,41.97 | 13.53,41.97 13.53,41.48 | 13.53,43.74 R4.1 | 13.53,41.48 13.5,41.46 13.5,38.79 13.53,38.82 C17.- | 18.33,38.54 19.22,39.17 18.49,39.9 C20.- 18.36,42.7 | 18.36,42.7 17.44,43.74 13.53,43.74 | 18.36,42.7 18.52,42.47 | 9.44,39.81 9.44,41.97 13.53,41.97 | 18.36,42.7 18.61,42.32 v20.23,40.44
  Top 0.406: 9.44,39.81 9.31,39.81 8.8,39.3 R5.2 | 37.41,34.44 37.41,36.94 41.38,36.94 42.16,36.16 42.18,36.17 C3.2 42.12,36.22 | 35.05,13.3 | 35.05,13.3 C7.2 37.21,13.3 41.91,13.3 41.93,11.12 C8.- 43.41,11.12 45.85,13.55 45.85,13.57 | 22.35,12.79 22.3,12.79 C24.2 22.22,12.72 22.22,12.66 21.44,12.66 19.99,14.11 | C23.2 22.35,14.49 22.35,12.79 | 22.9,11.74 22.35,12.29 22.35,12.79 | 19.99,14.11 R1.1 | C9.- 49.66,11.03 49.66,11.01 48.41,11.01 45.85,13.57 | 11.56,31.46 | 14.27,32.57 12.66,32.57 11.56,31.46 | C22.1 5.85,23.97 9.02,23.97 9.4,23.59 9.4,14.32 11.98,11.74 20.03,11.74 19.99,14.11 | C4.2 15.5,22.82 14.87,22.82 13.25,24.44 | C5.2 16.94,36.79 17.02,36.79 17.02,37.22 18.33,38.54 | 21.7,5.66 U$9.P$2 23.86,5.66 24.76,6.57 L3.2 26.54,8.6 | 22.1,2.88 C26.2 22.35,2.5 22.73,2.12 40.89,2.12 | 26.54,8.6 C29.2 | 26.54,8.6 R19.1 | C27.- 45.72,4.03 43.81,2.12 40.89,2.12 | 40.89,2.12 40.89,4.03 R18.E | HEADPHONE.S 8.14,64.62 | HEADPHONE.S 9.23,64.99 | HEADPHONE.S 8.86,63.05 v8.13,62.32 | 20.45,56.61 C12.2 | C11.2 20.28,56.44 20.45,56.61 | 20.45,56.61 20.45,57.37 19.18,58.64 10.92,58.64 | C21.2 4.1,46.03 3.05,47.21 3.05,50.38 3.94,51.4 7.37,51.4 8.38,52.41 10.92,52.41 10.92,58.64 | 30.01,42.72 29.97,42.76 29.9,42.69 IC4.29 22.55,42.69 22.35,42.89 22.27,42.89 | 22.9,11.74 23.11,11.53 | v7.87,58.64 10.92,58.64
  Top 0.61: C4.2 17.09,24.09 17.14,24.09 17.14,24.12 IC1.15 17.14,24.2 17.14,25.29 18.08,26.22
  Bottom 0.305: 22.96,58.09 U$5.16 | 21.7,58.09 22.96,58.09 | 21.7,58.09 U$5.17 21.7,52.52 21.46,52.29 21.46,51.78 21.84,50.64 21.84,47.97 23.53,46.28 23.54,46.28 | 33.12,58.09 U$5.8 | 30.59,58.09 U$5.10 | 30.59,58.09 33.12,58.09 | U$5.1 42.02,58.09 33.12,58.09 | U$5.11 29.32,57.46 | 22.96,58.09 22.9,58.09 | U$5.14 25.44,55.43 arc22 U$5.39 24.43,55.43 U$5.15 24.23,58.09 24.3,58.09 | U$5.11 29.32,57.4 | 29.32,58.09 U$5.11 | 22.96,58.09 24.3,58.09 | 24.3,58.09 28.11,58.09 | 28.11,58.09 29.32,58.09 | 29.32,58.09 30.59,58.09 | U$5.12 28.05,58.09 28.11,58.09 | 11.05,58.09 21.7,58.09 | U$5.50 10.84,55.48 10.84,58 10.84,58.09 | 40.77,8.6 32.77,8.6 27.81,13.55 27.81,15.71 28.45,16.35 30.35,16.35 30.48,16.22 30.52,16.22
  Bottom 0.406: v30.52,14.91 30.52,16.22 30.52,17.33 v26.2,21.64 | 23.54,46.28 23.54,45.01 22.27,43.74 v22.27,43.11 20.36,41.2 v20.23,40.44 | 40.77,8.6 R18.E | 10.84,58.09 11.05,58.09 10.07,57.49 7.37,57.49 6.86,56.99 6.86,56.1 3.68,56.1 3.68,48.98 5.46,48.98 5.46,24.22 3.05,21.81 U$2.P$1 | 10.84,58 10.79,58 8.95,59.84 | v8.13,62.32 8.13,60.67 8.95,59.84 | v7.87,58.64 7.87,58.76 8.95,59.84
MCLR
  Top 0.406: IC4.18 28.96,47.84 30.01,46.79 33.06,46.79 34.71,48.44 34.71,49.71 43.89,58.89 44.07,58.89 JP1.1
  Bottom 0.406: D2.C 46.86,37.77 46.86,43.78 48.64,45.56 48.64,48.73 43.94,53.43 43.94,59.53 44.07,59.53 44.2,59.65 JP1.1
MP3DATA  (via drill 0.61, 0.71)
  Top 0.305: IC4.23 23.96,47.76 23.49,48.22 23.49,49.87 24.26,50.64 24.26,51.65 25.4,52.8 25.4,54.19 22.48,57.11 R20.1
  Top 0.406: IC1.28 33.7,23.93 33.95,23.93 35.6,25.58 35.56,26.47 v35.56,30.32 | IC4.23 25.12,47.49 25.78,46.83 25.78,45.56 26.54,44.79 v28.32,44.79
  Bottom 0.406: v28.32,44.79 29.08,44.03 29.08,31.71 30.48,30.32 v35.56,30.32
N$2
  Top 0.254: 20.09,5.66 20.57,5.17 20.57,4.03
  Top 0.406: R16.1 21.46,8.6 20.83,7.96 20.83,6.19 20.3,5.66 U$9.P$5 | 17.02,6.19 16.53,6.67 R14.2 16.53,8.57 16.51,8.6 16.51,9.36 15.62,10.25 9.91,10.25 5.59,5.93 FM_SWITCH.P$3 | 17.02,6.19 R15.2 | U$9.P$5 17.55,5.66 17.02,6.19 | U$9.P$5 20.09,5.66 | C26.1 19.55,3.01 20.57,4.03
N$3
  Top 0.406: IC1.21 24.81,20.5 26.46,20.5 28.11,18.85 28.11,17.71 28.49,17.33 32.21,17.33 32.21,17.71 | 32.21,17.71 32.21,17.74 | 32.21,17.71 C6.1 37.31,17.61 37.21,17.84 | 37.21,17.84 37.21,17.94 | 37.21,17.84 R10.2 37.2,17.62 37.34,17.62 37.34,20.21 Q1.2
N$4
  Top 0.406: IC1.20 23.54,19.61 26.2,19.61 27.22,18.6 27.22,17.33 28.34,16.21 34.93,16.21 C7.1 | Q1.1 38.7,31.34 40.39,29.65 40.39,18.44 | 40.17,18.34 40.17,18.44 40.39,18.44 | 40.11,17.36 40.11,17.24 | 40.11,17.36 40.11,17.84 R10.1 40.02,18.35 40.11,18.44 40.39,18.44 | C7.1 35.05,16.09 38.86,16.09 40.13,17.36 40.11,17.36 | C7.1
N$5  (via drill 0.71)
  Top 0.406: v40.51,59.27 34.42,53.18 33.53,53.18 32.16,51.81 IC4.14 | U$3.P$3 52.58,42.67 52.58,41.37 v54.1,39.84
  Bottom 0.406: v40.51,59.27 40.51,59.53 43.05,62.07 44.7,62.07 45.34,61.56 45.34,55.72 48.26,55.72 48.26,50.51 49.91,48.86 49.91,41.37 50.04,41.24 52.7,41.24 v54.1,39.84
N$6
  Top 0.406: IC1.17 19.73,22.53 17.53,20.33 17.53,19.14 17.66,19.14 C1.1 17.78,19.02 17.78,17.13 R2.1
N$7
  Top 0.305: 20.57,19.39 20.55,19.42 20.36,19.61
  Top 0.406: IC1.18 21,21.52 20.11,20.63 20.11,19.87 20.36,19.61 20.24,19.49 | R1.2 19.81,17.31 19.81,18.68 20.55,19.42 C1.2
N$8
  Top 0.406: 48.45,26.73 U$1.5 48.43,27.87 47.29,29.01 47.29,31.8 47.3,31.82 L1.P$1 47.29,32.06 | C9.+ 51.97,15.92 52.62,16.57 52.62,32.06 JP3.2 47.29,32.06 | 47.29,32.06 47.16,32.19
N$9
  Top 0.406: U$1.8 44.59,26.73 42.71,26.73 D1.A | D1.A 42.46,26.22 | L1.P$2 42.46,31.7 D1.A
N$10
  Top 0.406: U$4.2 19.98,27.36 23.54,30.92 IC1.9
N$11
  Top 0.406: IC1.10 22.27,31.3 19.6,28.63 U$4.3
N$12
  Top 0.406: U$4.4 15.02,29.9 15.24,29.68 19.09,29.65 21,31.55 IC1.11
N$13
  Top 0.406: U$4.5 15.41,31.17 15.92,30.66 18.71,30.66 19.73,31.68 IC1.12
N$14  (via drill 0.71)
  Top 0.406: v49.4,51.14 49.02,50.76 39.24,50.76 36.96,48.48 36.96,46.06 36.78,45.89 IC4.9 | U$3.P$1 52.58,53.78 52.58,55.34 v52.96,55.72
  Bottom 0.406: v49.4,51.14 50.67,52.41 50.67,55.72 v52.96,55.72
N$16
  Top 0.406: IC4.15 31.36,49.48 31.37,49.49 31.37,54.32 33.65,56.61 33.65,64.86 33.4,64.86 33.4,65.34 S3.2
N$17
  Top 0.406: U$4.15 7.41,27.36 6.26,28.5 5.12,28.5 4.96,28.47 C15.+
N$18
  Top 0.406: U$1.3 47.16,22.92 50.84,22.92 C10.1
N$19
  Top 0.406: R3.1 47.84,17.45 48.39,18 50.04,18 50.59,18.55 BATTLOW.A
N$20
  Top 0.406: U$1.4 48.39,20.6 48.39,21.14 BATTLOW.K
N$21
  Top 0.406: 11.81,22.92 10.96,23.04 10.2,22.28 10.2,15.42 10.55,15.08 11.68,15.08 11.68,15.22 C16.+ 13.18,13.81 13.92,13.81 | 11.81,22.92 11.85,22.92 | 11.85,22.92 C13.1 | U$4.14 10.84,28.63 10.84,25.33 11.81,24.35 11.81,22.92 | 11.85,22.92 11.76,23.2 | 13.92,13.81 13.97,13.81 | 13.92,13.81 L2.1
N$22
  Top 0.406: Q2.1 16.3,49.08 | Q2.1 16.04,48.31 21.12,43.23 21.12,42.35 21.47,42 | 21.47,42 21.5,41.97 | 21.47,42 21.46,42 21.59,41.87 21.61,41.89 IC4.30 | Q2.1 16.04,49.2 15.62,49.62 15.62,53.43 16.67,54.48 C11.1
N$23
  Top 0.406: 6.26,49.08 Q2.2 6.48,48.99 | IC4.31 21.24,41.09 20.11,42.22 20.11,42.85 15.54,47.43 12.95,47.43 12.32,47.46 12.32,48.6 11.94,48.98 10.29,48.98 9.78,48.48 9.74,47.43 8.04,47.43 6.48,48.99 | 6.48,48.99 8.51,51.02 14.1,51.02 14.6,51.52 14.6,54.95 16.35,56.7 C12.1
N$24
  Top 0.406: 9.06,31.17 U$4.12 9.13,31.19 | 7.25,41.81 C14.+ 7.62,41.85 7.62,41.87 7.19,41.87 6.01,40.7 6.01,37.77 6.52,37.27 6.52,32.19 7.53,31.17 9.11,31.17 9.13,31.19 | 9.13,31.19 9.14,31.21
N$25
  Top 0.406: C14.- 7.76,44.04 10.84,44 R4.2 10.84,43.87 11.09,43.49 13.38,45.77 R7.2
N$26
  Top 0.406: 4.49,37.14 4.46,37.16 R6.2 | R5.1 4.59,37.24 4.49,37.14 | 4.49,37.14 5.71,35.91 5.71,32.6 5.07,31.96 C15.-
N$28  (via drill 0.61, 0.71)
  Top 0.305: 3.94,17.49 3.94,17.36 v4.57,17.36
  Top 0.406: 4.32,34.13 R6.1 3.81,34.63 | 4.32,34.13 4.36,34.09 | 3.81,34.63 3.6,34.85 | 3.81,34.63 2.41,36.03 2.41,41.87 1.4,41.87 1.4,54.83 2.54,55.97 2.54,59.53 4.19,61.18 7.37,61.18 7.62,60.92 13.46,60.92 15.24,62.7 16.55,62.7 HEADPHONE.R | 3.81,34.63 | 3.94,17.49 3.94,26 4.67,26.73 C22.2 4.98,26.73 3.97,26.73 3.43,27.27 3.43,33.24 4.32,34.13 | R11.1 27.56,3.39 26.03,4.92 v25.91,4.92
  Bottom 0.305: 19.94,10.38 19.94,13.17 18.8,14.31 7.62,14.31 v4.57,17.36
  Bottom 0.406: 19.94,10.38 19.94,4.92 v25.91,4.92
N$29
  Top 0.406: U$4.9 9.19,35.04 9.19,35.11 10.2,35.11 11.06,35.97 C17.+ 10.81,38.38 10.84,38.79 10.83,39.05 C18.1
N$30
  Top 0.406: U$4.10 10.58,33.71 12.23,35.36 12.23,36.5 14.9,36.5 15.41,37.01 15.41,38.54 15.92,39.04 16.42,39.04 16.42,38.92 C19.1 15.92,38.79 15.92,41.71 C20.+
N$31
  Top 0.305: R13.2 29.84,10 24.89,10 23.88,8.98
  Top 0.406: U$9.P$3 22.23,6.7 23.62,8.09 C29.1 23.88,8.85 23.88,8.98 23.88,9.11
N$32
  Top 0.406: C24.1 25.31,12.75 R8.1
N$33
  Top 0.406: R8.2 25.09,17.84 22.39,17.84 | C23.1 22.39,17.84 | IC1.19 22.39,24.03 22.39,17.84
N$35
  Top 0.406: C25.1 17.02,3.14 16.89,3.27 | R15.1 14.2,5.96 16.89,3.27 | U$9.P$6 18.33,4.71 16.89,3.27
N$36
  Top 0.406: R16.2 18.67,8.6 19.58,7.69 U$9.P$4
N$37  (via drill 0.71)
  Top 0.406: C21.1 4.41,43.23 5.97,44.79 5.97,45.94 6.6,46.57 9.27,46.57 10.07,45.77 R7.1 10.81,47.61 v11.05,47.84 | C21.1 4.32,43.27 | 4.06,43.52 4.06,43.78 | 4.32,43.27 4.06,43.52 | 4.32,43.27 C21.1 | HEADPHONE.T 8.46,55.72 5.33,55.72 2.29,52.67 2.29,44.67 3.17,43.52 4.06,43.52 | v33.91,6.31 36.19,8.6 R12.1
  Bottom 0.305: 21.21,9.87 21.21,13.55 19.18,15.58 9.91,15.58 8.76,16.73 8.89,16.85
  Bottom 0.406: v11.05,47.84 11.05,38.57 8.89,36.41 8.89,16.85 | 21.21,9.87 21.21,8.09 22.99,6.31 v33.91,6.31
N$38
  Top 0.406: R19.2 31.27,8.5 31.24,8.47 31.69,8.03 | 31.69,8.03 32,7.71 C28.1 32.25,6.32 32.26,6.31 32.26,4.92 27.56,4.92 R11.2 | R12.2 32.26,8.6 31.69,8.03
N$39
  Top 0.406: R18.A 38.35,4.15 40.77,6.57 44.83,6.57 45.47,7.2 | C27.+ 45.64,7.28 45.59,7.33 45.47,7.2 | R14.1 11.3,8.47 9.78,6.95 9.78,4.41 12.95,1.23 46.35,1.23 47.62,2.5 47.62,5.04 45.47,7.2
N$40
  Top 0.406: R13.1 29.95,3.49 29.97,3.52 C28.2 32.76,3.52 35.56,6.31 37.72,6.31 38.23,6.82 R18.S
N$42
  Top 0.406: L3.1 23.32,4.71 U$9.P$1
N$43
  Top 0.406: U$3.P$2 54.07,42.89 54.1,42.89 54.1,53.45 U$3.P$0 54.23,53.72 54.23,56.61 51.31,61.56 47.52,65.34 S4.1 45.34,65.24 45.21,65.37 45.21,65.88 44.2,66.89 38.73,66.89 37.69,65.6 37.97,65.6 37.97,65.34 | 37.97,65.34 37.97,65.11 | S3.1 37.97,65.34
  Bottom 0.406: U$2.P$2 4.06,26.25 4.06,42.76 2.29,44.54 2.29,59.53 10.16,65.88 16.26,65.88 17.14,66.77 21.34,66.77 22.48,65.62 S2.1 22.45,65.39 22.48,65.37 23.88,66.77 29.08,66.77 30.23,65.62 S1.1 31.62,66.89 36.96,66.89 37.85,66 37.85,65.37 37.92,65.37 S3.1
RDY  (via drill 0.71)
  Top 0.305: IC4.22 25.78,49.27 25.78,49.24 v24.46,49.24
  Bottom 0.305: 24.26,49.24 | 24.26,49.24 24.3,49.2 | U$5.37 27.41,52.92 26.9,52.41 25.15,52.41 24.64,51.91 24.64,49.24 v24.46,49.24 24.26,49.24
RESET  (via drill 0.61)
  Top 0.305: IC4.24 22.87,46.69 22.48,47.08 22.48,51.4 v22.61,51.52
  Bottom 0.305: v22.61,51.52 22.61,52.54 22.41,52.73 | 22.41,52.73 22.35,52.8 | 22.41,52.73 22.35,52.67 22.33,52.69 U$5.41
RX  (via drill 0.61)
  Top 0.305: 20.19,63.34 v23.62,59.91 24,59.91 26.42,57.49 26.42,55.46 29.76,52.12
  Top 0.406: IC4.1 42.4,39.49 42.46,41.71 42.84,42.09 42.84,43.23 49.75,43.23 50.55,44.29 50.55,55.84 50.04,56.61 46.61,56.61 JP1.2 | 29.76,52.12 IC4.17 | S2.2 18.14,65.47 18.16,65.49 20.19,63.46 20.19,63.34
  Bottom 0.254: 46.23,64.73 45.08,63.97
  Bottom 0.305: 45.08,63.97 43.69,63.97 39.62,59.91 v23.62,59.91 | 46.23,64.73 47.12,64.73 48.13,63.72 48.13,62.07 46.99,60.92 46.99,60.16 46.61,59.78 JP1.2
S$1
  Top 0.406: 34.33,27.49 arc-166 34.33,29.52
STA_SCL
  Top 0.305: IC4.36 27.36,36.49 28.49,35.36 29,35.36 29.89,34.47 IC1.4
STA_SCLK
  Top 0.305: 21,36.88 21.63,36.25 25.44,36.25 27.35,34.34
  Top 0.406: IC4.32 21.61,40.29 21,39.68 21,36.88 | 27.35,34.34 IC1.6
STA_SDA
  Top 0.305: IC4.37 28.16,36.71 28.62,36.25 29.37,36.25 29.92,35.7 30.52,35.11 31.16,34.47 | IC1.3 31.16,34.34 31.36,34.64 32.96,36.24 35.43,36.24 35.99,35.62
  Top 0.406: 31.16,34.47 31.16,34.34 | 35.99,35.62 R9.1
STA_SDI
  Top 0.305: IC1.5 28.62,34.22 26.67,36.16 26.58,36.25
  Top 0.406: 26.67,36.16 26.56,36.27 IC4.35
TX
  Top 0.406: IC4.44 33.88,37.81 34.16,37.81 45.04,37.82 46.82,39.54 49.4,42.13 50.8,42.13 51.56,43.14 51.56,56.99 JP1.3 | 30.48,52.8 27.56,55.72 27.56,63.46 S1.2 | 30.48,52.8 30.61,52.67 | IC4.16 30.56,52.72 30.48,52.8
  Bottom 0.305: 49.15,59.53 JP1.3 49.15,63.72 47.37,65.49 46.86,65.49 45.85,66.64 44.32,66.64 43.31,65.49 43.31,64.99 41.66,63.34 41.66,62.83 39.37,60.54 30.35,60.54
  Bottom 0.406: 25.53,65.49 S1.2 30.35,60.67 30.35,60.54
VCC  (via drill 0.61, 0.71)
  Top 0.305: v24.55,35.23 24.81,34.73 | v18.58,52.38 19.22,53.01 22.61,53.01 23.41,53.01 v23.66,52.76 | IC4.28 29.63,43.49 30.39,44.25 36.11,44.25 36.11,44.29 | v18.41,12.79 17.43,13.77
  Top 0.406: IC1.23 27.25,24.16 | R2.2 14.62,16.92 14.67,16.92 15.54,17.79 C4.1 15.53,19.74 15.49,19.78 18.46,22.74 IC1.16 | IC1.23 27.35,22.79 28.24,21.9 28.24,20.12 29.25,19.11 29.76,19.11 | 29.76,19.11 C2.1 34.33,18.98 v36.74,21.39 36.74,32.63 33.7,32.63 IC1.1 | v29,14.66 28.74,14.66 26.71,16.69 21.38,16.69 21.12,15.8 18.08,15.8 | 29.76,19.11 30.52,19.11 v31.66,20.25 | IC1.23 27.45,24.16 27.47,24.19 27.5,24.16 IC1.24 | 24.81,34.73 IC1.8 | IC4.7 36.11,44.29 37.09,44.29 v37.25,43.87 | R17.2 44.36,45.52 46.14,47.3 D2.A | C8.+ 41.95,15.93 42.94,15.93 44.41,17.4 | 44.41,17.4 R3.2 | 47.12,26.71 47.12,26.63 | 47.12,26.71 U$1.6 | 47.12,26.71 47.12,27.91 45.22,29.81 45.21,29.81 45.21,34.12 | 42.54,19.36 D1.C 42.42,19.39 41.92,19.39 41.19,20.12 41.19,33.83 | 42.54,19.36 43.4,19.36 | 43.4,19.36 44.62,20.58 U$1.1 44.62,20.62 | 44.62,20.62 44.58,20.66 | U$1.2 44.64,20.6 44.62,20.62 | 42.54,19.36 42.54,19.39 | 42.54,19.36 42.54,19.27 | 45.08,36.41 44.96,36.29 44.98,36.26 C3.1 45.08,36.22 45.08,34.12 | R9.2 39.56,35.46 41.19,33.83 | 41.19,33.83 41.23,33.83 41.52,34.12 | 41.52,34.12 43.88,34.12 | R2.2 15.02,16.82 15.91,15.8 18.08,15.8 | L2.2 17.43,13.77 17.49,13.77 18.08,14.36 18.08,15.8 | 44.41,17.4 44.32,17.49 44.32,18.44 43.4,19.36 | IC1.14 17.19,34.55 17.78,35.14 18.67,35.14 19.81,36.29 19.77,36.32 C5.1 19.77,36.2 20.83,35.14 24.26,35.14 24.35,35.23 | 24.35,35.23 24.38,35.27 | v24.55,35.23 24.35,35.23 | 41.52,34.12 45.08,34.12 | 45.08,34.12 45.21,34.12 | 45.21,34.12 46.99,34.12 v46.99,34.89 | 45.21,34.12 45.21,34.13 | R2.2 13.61,17.35 v13.59,19.14 | 22.61,53.01 22.61,53.05 22.48,53.18 R20.2
  Bottom 0.305: U$5.32 33.76,52.89 33.03,52.15 32.89,52.02 32.89,46.62 32.87,46.6 | U$5.44 18.52,52.44 v18.58,52.38 | v23.66,52.76 23.92,52.67 23.88,52.67 24.38,53.18 26.16,53.18 | 26.16,53.18 26.2,53.18 | 26.16,53.18 U$5.38 26.67,55.48 | 26.67,55.48 U$5.13 | 26.67,55.48 26.67,55.46 | v18.41,12.79 18.41,10.63 18.16,10.38
  Bottom 0.406: 35.6,43.87 v37.25,43.87 | 35.6,43.87 29.89,38.16 29.89,33.58 30.78,32.69 38.52,32.69 40.98,35.06 | 40.98,35.06 45,38.92 45,39.08 | 45,39.08 45,45.01 D2.A | 34.2,45.2 34.27,45.2 35.6,43.87 | 34.2,45.2 29.57,45.2 27.35,47.43 23.79,47.43 22.77,48.44 22.77,49.97 23.88,51.07 23.88,52.67 v23.66,52.76 | 34.2,45.2 34.2,45.27 32.87,46.6 | 31.51,20.24 31.54,20.21 v31.66,20.25 31.62,20.25 | 38.71,18.26 36.7,18.26 36.7,21.39 v36.74,21.39 | 38.71,18.26 38.71,18.34 38.78,18.4 | D1.C 42.42,19.39 42.35,19.33 | 38.71,18.26 41.28,18.26 42.35,19.33 | 42.35,19.33 42.42,19.27 41.53,18.38 | 24.38,35.27 24.33,35.27 v24.55,35.23 24.3,35.14 10.41,35.14 10.03,34.76 10.03,19.9 10.79,19.14 11.16,19.13 12.31,19.13 v13.59,19.14 | 45,39.08 45.08,39.08 | 40.98,35.06 41.02,35.02 46.86,35.02 v46.99,34.89 | v29,14.66 29.07,14.61 | 29.07,14.61 29.25,14.48 29.21,14.06 29.5,13.77 32.3,13.77 32.26,18.25 31.62,18.25 31.62,20.25 | 31.62,20.25 31.62,20.28 | 28.96,14.44 29.07,14.56 29.07,14.61 | FM_SWITCH.P$2 5.84,8.47 7.49,10.12 17.91,10.12 18.16,10.38 | 33.03,52.15

### Text on the board
Bottom: ladyada@mit.edu | Minty MP3 v1.1